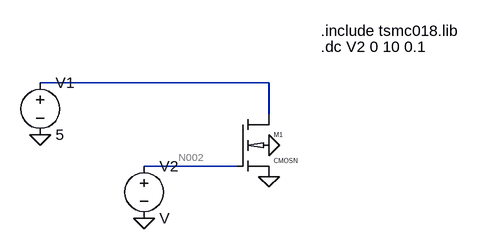
[diagram p0: schematic Draft3.asc]
Draft3.asc, the LTspice schematic file:
Version 4
SHEET 1 880 680
WIRE 368 48 16 48
WIRE 368 96 368 48
WIRE 320 176 176 176
FLAG 16 128 0
FLAG 176 256 0
FLAG 368 192 0
FLAG 368 144 0
SYMBOL voltage 16 32 R0
WINDOW 123 0 0 Left 2
WINDOW 39 0 0 Left 2
SYMATTR InstName V1
SYMATTR Value 5
SYMATTR Value2 ""
SYMATTR SpiceLine ""
SYMBOL voltage 176 160 R0
SYMATTR InstName V2
SYMBOL cmosn 320 96 R0
SYMATTR InstName M1
SYMATTR SpiceModel ""
SYMATTR Value2 l=0.36u w=0.72u
SYMATTR SpiceLine ""
SYMATTR SpiceLine2 ""
TEXT 448 -32 Left 2 !.include tsmc018.lib
TEXT 448 -8 Left 2 !.dc V2 0 10 0.1

The netlist it stands for:
* Draft3.asc
V1 N001 0 5
V2 N002 0 V
M1 N001 N002 0 0 CMOSN l=0.36u w=0.72u
.model NMOS NMOS
.model PMOS PMOS
.lib standard.mos
.include tsmc018.lib
.dc V2 0 10 0.1
.lib tsmc018.lib
.backanno
.end

* Results of the author's LTspice run, read from the files saved beside the schematic
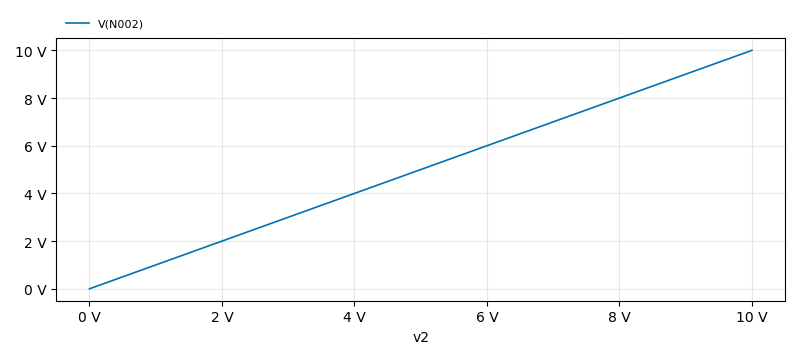
[diagram p1: DC transfer characteristic of Draft3.asc, plotted from the saved traces]
* DC transfer characteristic, 1 run:
*   V(N002): 0 V at v2=0 V, 10 V at v2=10 V, min 0 V, max 10 V